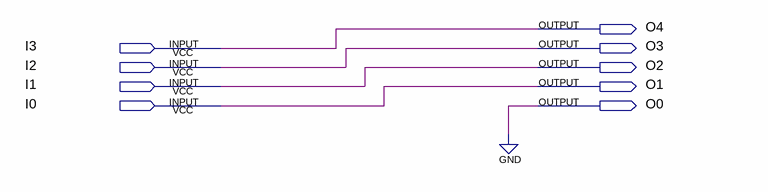
[diagram p0: schematic sheet]
// Quartus schematic ShiftLeft.bdf as structural Verilog: 0 symbols, 9 pins
module ShiftLeft (
  input  I3,
  input  I2,
  input  I1,
  input  I0,
  output O4,
  output O3,
  output O2,
  output O1,
  output O0
);


  assign O0 = 1'b0;
  assign O1 = I0;
  assign O2 = I1;
  assign O3 = I2;
  assign O4 = I3;
endmodule
